# EAGLE schematic asset-tracker-v002 (EAGLE 7.5.0)
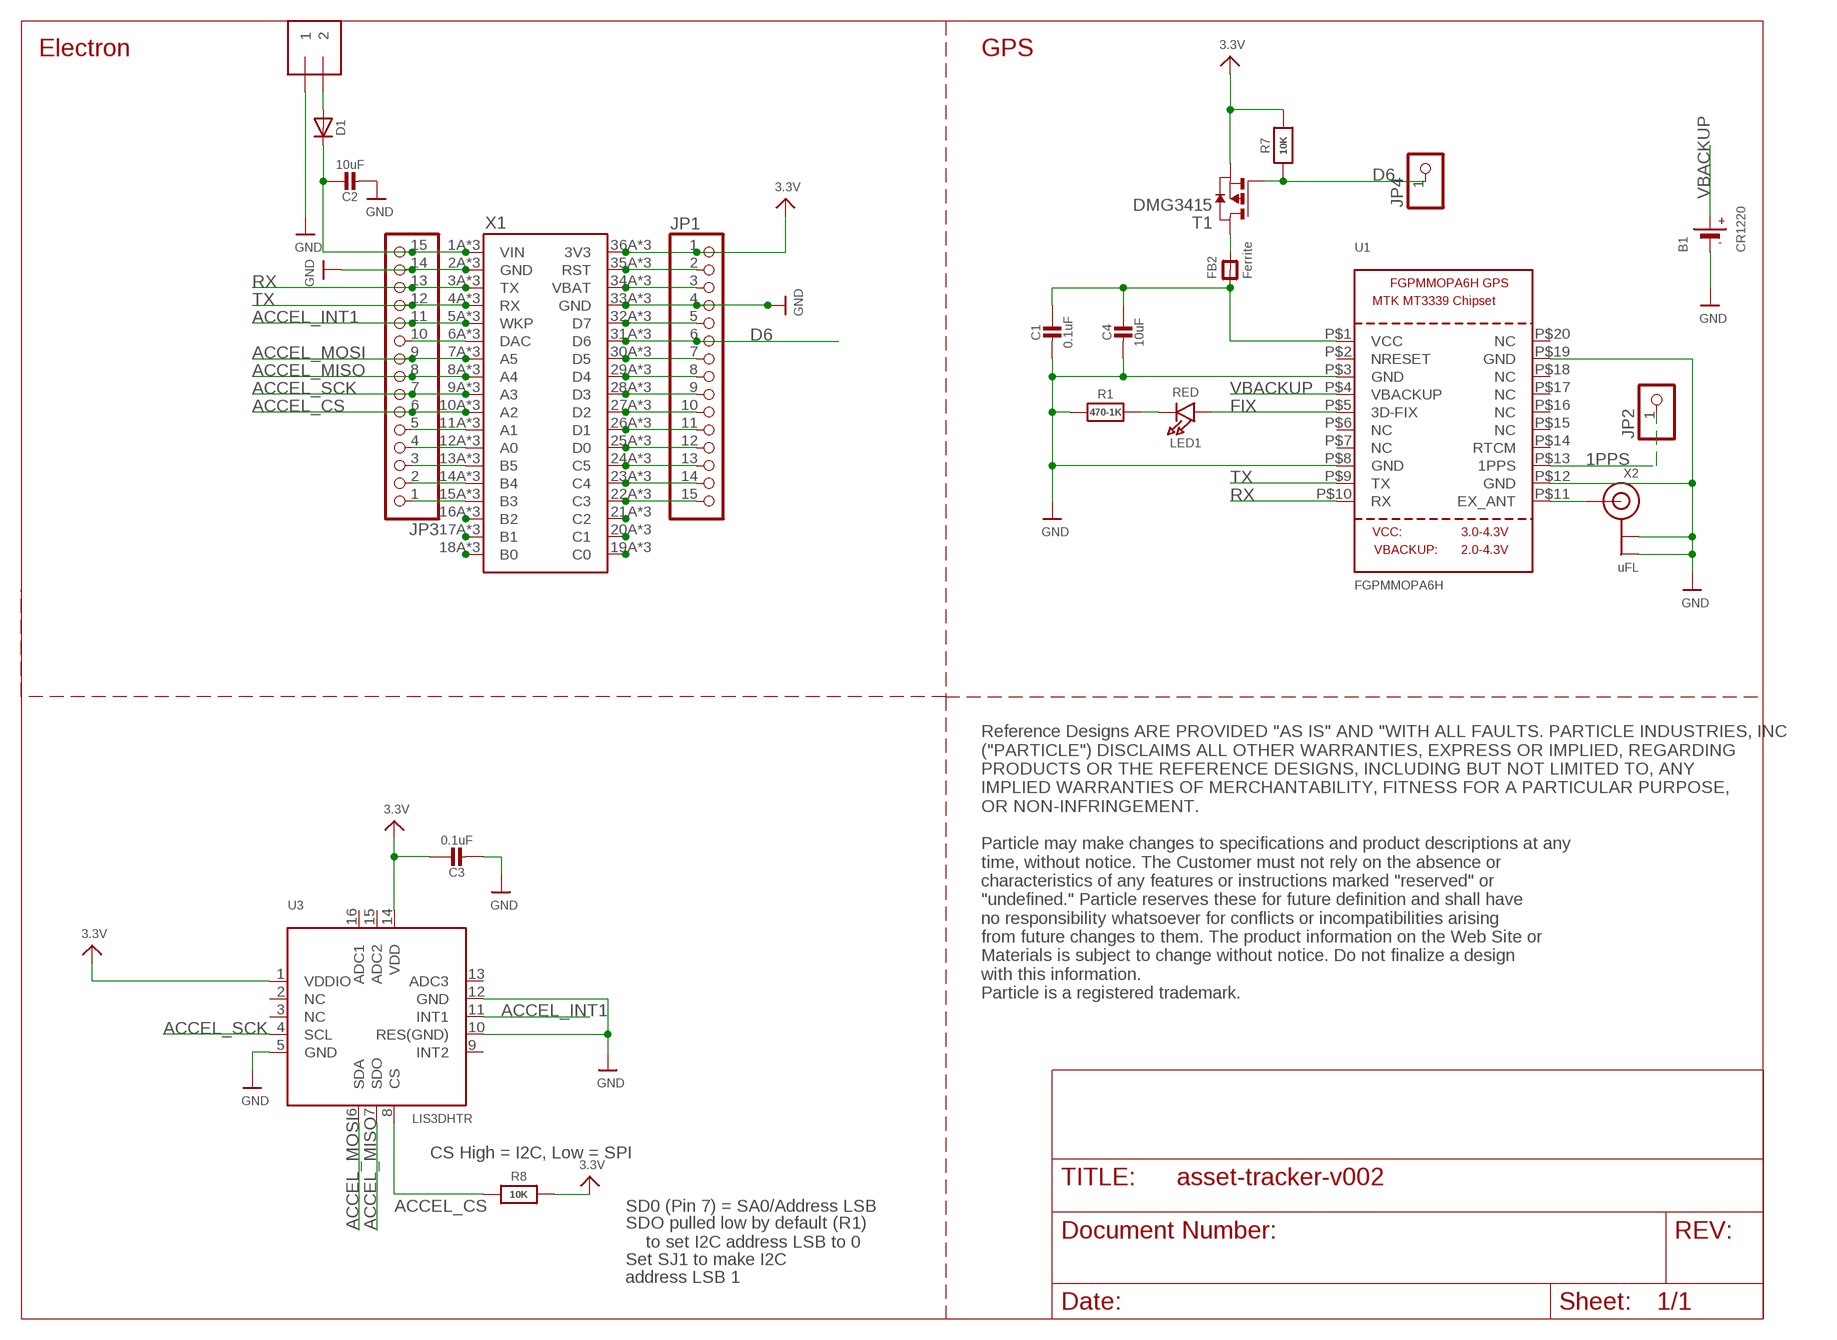
[diagram p0: schematic, sheet 1]

## Parts
B1  CR1220  BATTERYCR1220_SMT  [CR1220]
C1  0.1uF  CAP_CERAMIC0805-NOOUTLINE  [0805-NO@1]
C2  10uF  CAP_CERAMIC0805-NOOUTLINE  [0805-NO@1]
C3  0.1uF  CAP_CERAMIC0805_10MGAP  [0805_10MGAP]
C4  10uF  CAP_CERAMIC0805-NOOUTLINE  [0805-NO@1]
D1  DIODESMA  [SMADIODE]
FB2  Ferrite  FERRITE-0805NO  [0805-NO@1]
J1  1X2-3.5MM  [1X2-3.5MM]
JP1  HEADER-1X15  [1X15_ROUND_70]
JP2  HEADER-1X1ROUND  [1X01_ROUND]
JP3  HEADER-1X15  [1X15_ROUND_70]
JP4  HEADER-1X1ROUND  [1X01_ROUND]
LED1  RED  LED0805_NOOUTLINE  [CHIPLED_0805_NOOUTLINE]
R1  470-1K  RESISTOR0805_NOOUTLINE  [0805-NO]
R7  10K  RESISTOR0805_NOOUTLINE  [0805-NO]
R8  10K  RESISTOR0805_NOOUTLINE  [0805-NO]
T1  DMG3415  PMOSSOT23  [SOT-23]
U1  FGPMMOPA6H  GPS_FGPMMOPA6H  [FGPMMOPA6H]
U3  LIS3DHTR  ACCEL_LIS3DHTR  [LGA16_3X3MM]
X1  ELECTRON  ELECTRON_SMT  [ELECTRON_SMT]
X2  uFL  ANTENNA_U.FL  [U.FL]

## Nets
1PPS: JP2.1 U1.P$13(1PPS)
3.3V: C3.1 JP1.1 R7.2 R8.2 T1.2(S) U3.1(VDDIO) U3.14(VDD) X1.36A(3V3) X1.36B(3V3) X1.36C(3V3)
A0: JP3.4 X1.12A(A0) X1.12B(A0) X1.12C(A0)
A1: JP3.5 X1.11A(A1) X1.11B(A1) X1.11C(A1)
ACCEL_CS: JP3.6 R8.1 U3.8(CS) X1.10A(A2) X1.10B(A2) X1.10C(A2)
ACCEL_INT1: JP3.11 U3.11(INT1) X1.5A(WKP) X1.5B(WKP) X1.5C(WKP)
ACCEL_MISO: JP3.8 U3.7(SDO) X1.8A(A4) X1.8B(A4) X1.8C(A4)
ACCEL_MOSI: JP3.9 U3.6(SDA) X1.7A(A5) X1.7B(A5) X1.7C(A5)
ACCEL_SCK: JP3.7 U3.4(SCL) X1.9A(A3) X1.9B(A3) X1.9C(A3)
B3: JP3.1 X1.15A(B3) X1.15B(B3) X1.15C(B3)
B4: JP3.2 X1.14A(B4) X1.14B(B4) X1.14C(B4)
B5: JP3.3 X1.13A(B5) X1.13B(B5) X1.13C(B5)
C3: JP1.15 X1.22A(C3) X1.22B(C3) X1.22C(C3)
C4: JP1.14 X1.23A(C4) X1.23B(C4) X1.23C(C4)
C5: JP1.13 X1.24A(C5) X1.24B(C5) X1.24C(C5)
D0: JP1.12 X1.25A(D0) X1.25B(D0) X1.25C(D0)
D1: JP1.11 X1.26A(D1) X1.26B(D1) X1.26C(D1)
D2: JP1.10 X1.27A(D2) X1.27B(D2) X1.27C(D2)
D3: JP1.9 X1.28A(D3) X1.28B(D3) X1.28C(D3)
D4: JP1.8 X1.29A(D4) X1.29B(D4) X1.29C(D4)
D5: JP1.7 X1.30A(D5) X1.30B(D5) X1.30C(D5)
D6: JP1.6 JP4.1 R7.1 T1.3(G) X1.31A(D6) X1.31B(D6) X1.31C(D6)
D7: JP1.5 X1.32A(D7) X1.32B(D7) X1.32C(D7)
DAC: JP3.10 X1.6A(DAC) X1.6B(DAC) X1.6C(DAC)
FIX: LED1.A U1.P$5(3D-FIX)
GND: B1.- C1.2 C2.2 C3.2 C4.2 J1.1 JP1.4 JP3.14 R1.1 U1.P$3(GND) U1.P$8(GND) U1.P$12(GND) U1.P$19(GND) U3.5(GND) U3.10(RES(GND)) U3.12(GND) X1.2A(GND) X1.2B(GND) X1.2C(GND) X1.33A(GND) X1.33B(GND) X1.33C(GND) X2.1(GND) X2.2(GND)
N$1: C1.1 C4.1 FB2.1 U1.P$1(VCC)
N$2: LED1.C R1.2
N$4: U1.P$11(EX_ANT) X2.3(SIGNAL)
N$8: C2.1 D1.C JP3.15 X1.1A(VIN) X1.1B(VIN) X1.1C(VIN)
N$9: D1.A J1.2
N$10: X1.16A(B2) X1.16B(B2) X1.16C(B2)
N$11: X1.17A(B1) X1.17B(B1) X1.17C(B1)
N$12: X1.18A(B0) X1.18B(B0) X1.18C(B0)
N$13: X1.21A(C2) X1.21B(C2) X1.21C(C2)
N$14: X1.20A(C1) X1.20B(C1) X1.20C(C1)
N$15: X1.19A(C0) X1.19B(C0) X1.19C(C0)
RST: JP1.2 X1.35A(RST) X1.35B(RST) X1.35C(RST)
RX: JP3.13 U1.P$10(RX) X1.3A(TX) X1.3B(TX) X1.3C(TX)
TX: JP3.12 U1.P$9(TX) X1.4A(RX) X1.4B(RX) X1.4C(RX)
VBACKUP: B1.+$1(+) U1.P$4(VBACKUP)
VBAT: JP1.3 X1.34A(VBAT) X1.34B(VBAT) X1.34C(VBAT)
VCC: FB2.2 T1.1(D)
Unconnected: U1.P$2(NRESET) U1.P$6(NC) U1.P$7(NC) U1.P$14(RTCM) U1.P$15(NC) U1.P$16(NC) U1.P$17(NC) U1.P$18(NC) U1.P$20(NC) U3.2(NC) U3.3(NC) U3.9(INT2) U3.13(ADC3) U3.15(ADC2) U3.16(ADC1)

## Notes on the sheet
- Electron | GPS
- Reference Designs ARE PROVIDED "AS IS" AND "WITH ALL FAULTS. PARTICLE INDUSTRIES, INC 
  ("PARTICLE") DISCLAIMS ALL OTHER WARRANTIES, EXPRESS OR IMPLIED, REGARDING 
  PRODUCTS OR THE REFERENCE DESIGNS, INCLUDING BUT NOT LIMITED TO, ANY 
  IMPLIED WARRANTIES OF MERCHANTABILITY, FITNESS FOR A PARTICULAR PURPOSE,
  OR NON-INFRINGEMENT.
  
  Particle may make changes to specifications and product descriptions at any 
  time, without notice. The Customer must not rely on the absence or 
  characteristics of any features or instructions marked "reserved" or 
  "undefined." Particle reserves these for future definition and shall have 
  no responsibility whatsoever for conflicts or incompatibilities arising 
  from future changes to them. The product information on the Web Site or 
  Materials is subject to change without notice. Do not finalize a design 
  with this information. 
  Particle is a registered trademark.
- CS High = I2C, Low = SPI
- SD0 (Pin 7) = SA0/Address LSB
- SDO pulled low by default (R1) 
      to set I2C address LSB to 0
- Set SJ1 to make I2C
- address LSB 1

## Library data of the parts
B1 = microbuilder:BATTERY: CR1220 SMT - Digikey: 3001K-ND CD2032 BAT-HLD-001 - Digikey: BAT-HLD-001-ND
C1-C4 = microbuilder:CAP_CERAMIC: Ceramic Capacitors For new designs, use the packages preceded by an '_' character since they are more reliable: The following footprints should be used on most boards: _0402 - Standard footprint for regular board layouts _0603 - Standard footprint for regular board layouts _0805 - Standard footprint for regular board layouts _1206 - Standard footprint for regular board layouts For extremely tight-pitch boards where space is at a premium, the following 'micro-pitch' footprints can be used (smaller pads, no silkscreen outline, etc.): _0402MP - Micro-pitch footprint for very dense/compact boards _0603MP - Micro-pitch footprint for very dense/compact boards _0805MP - Micro-pitch footprint for very dense/compact boards _1206MP - Micro-pitch footprint for very dense/compact boards
D1 = microbuilder:DIODE: Diode SMA Model Volts Amps Type Vf Ir Digikey # Notes SSA34-E3 40V 3A Schottky 480mV @ 3A 200uA @ 40V SSA34-E3/61TGITR-ND CDBA120-G 20V 1A Schottky 500mV @ 1A 500uA @ 20V 641-1014-6-ND REEL MBRA210 10V 2A Schottky 350mV @ 2A 700uA @ 10V MBRA210LT3 SOD-123 Model Volts Amps Type Vf Ir Order # Notes BAT54T1G 30V 200mA Schottky 800mV @ 200mA 2uA @ 25V BAT54T1GOSTR-ND B0530W 30V 500mA Schottky 430mV @ 500mA 130uA @ 30V B0530W-FDICT-ND REEL MBR120 20V 1A Schottky 340mV @ 1A MBR120VLSFT1GOSCT-ND SOD-323 Model Volts Amps Type Vf Ir Order # Notes PMEG2005EJ 20V 500mA Schottky 355mV @ 500mA 568-4110-1-ND ZLLS410 10V 570mA Schottky 380mV @ 570mA ZLLS410CT-ND 1N4148WS 75V 150mA Silicon/Simple 1V 1N4148WSFSCT-ND REEL SOD-523 Model Volts Amps Type Vf Ir Order # Notes BAT54XV2 30V 200mA Schottky 0.8V @ 100mA BAT54XV2CT-ND TB751S 30V 30mA Schottky RB751S-40TE61CT-ND SOT23-R/W (R = Solder Paste/Reflow Ovens, W = Hand-Soldering) Model Volts Amps Type Vf Ir Order # Notes BAT54FILM 40V 300mA Schottky 497-7162-1-ND POWERDI-5 Model Volts Amps Type Vf Ir Order # Notes PDS560 60V 5A Schottky 670mV @ 5A 150uA @ 60V PDS560DICT-ND
FB2 = microbuilder:FERRITE: Ferrite Bead 0603 MMZ1608B121C - 120 Ohm @ 100MHz, 600mA, 0.15 Ohm DC Resistance - Digikey: 445-2164-1-ND BK1608HW121-T - 120 Ohm, 600mA Ferrite Chip - Digikey: 587-1876-2-ND 0805 HZ0805B272R-10 - 2.7K Ohm @ 100MHz, 200mA, 0.8 Ohm DC Resistance - Digikey: 240-2504-1-ND (see also Murata BLM21BD272SN1L) MMZ2012Y152B - 1.5K Ohm @ 100MHz, 500mA, 0.4 Ohm DC Resistance - Digikey: 445-1560-1-ND - Mainly for high frequency (80-400MHz) MMZ2012R102A - 1K Ohm @ 100MHz, 500mA, 0.3 Ohm DC Resistance - Digikey: 445-1555-2-ND - More general purpose (10-200MHz)
J1 = adafruit2:1X2: 3.5mm Terminal block http://www.ladyada.net/library/pcb/eaglelibrary.html
JP1 JP3 = microbuilder:HEADER-1X15: 1x15 Header
JP2 JP4 = microbuilder:HEADER-1X1: PIN HEADER
LED1 = microbuilder:LED: LED 0603 - 0603 Surface Mount Package 2mA: Green LED - Low Power (3.9mcd, 2ma, 1.7Vf) - Digikey: 475-2709-2-ND Orange LED - Low Power (9.8mcd, 2ma, 1.8Vf) - Digikey: 475-1194-2-ND Red LED - Low Power (5mcd, 2ma, 1.8Vf) - Digikey: 475-1195-2-ND Yellow LED - Low Power (7mcd, 2ma, 1.8Vf) - Digikey: 475-1196-2-ND 5mA: Blue LED - Low Power (17mcd, 5ma, 2.9Vf) - Digikey: LNJ937W8CRACT-ND 0805 - 0805 Surface Mount Package 2mA: Red LED (8.8mcd, 2mA, 1.8Vf, Clear) - Low Power [Digikey: 475-2510-1-ND] Green LED (5mcd, 2mA, 1.8Vf, Clear) - Low Power [Digikey: 475-2730-1-ND] Yellow LED (11.3mcd, 2mA, 1.8Vf, Clear) - Low Power [Digikey: 475-2555-1-ND] 20mA: Red LED (104mcd, 20mA, Diffused) - LS R976 [Digikey: 475-1278-6-ND] Red LED (12mcd, 20mA, 2.0Vf, Clear) - APT2012EC [Digikey: 754-1128-1-ND] Green LED (15mcd, 20mA, 2.2Vf, Clear) - APT2012GC [Digikey: 754-1131-1-ND] Orange LED (160mcd, 20mA, 2.1Vf, Clear) - APT2012SECK [Digikey: 754-1130-1-ND] 1206 - 1206 Surface Mount Package Green LED (26mcd, 20mA, Diffused) - LG N971 [Digikey: 475-1407-6-ND] Red LED (15mcd, 20mA, Diffused) - LH N974 [Digikey: 475-1416-6-ND] Cree - Cree High-Power Surface Mount LEDs XPEBWT-L1-0000-00D50 - White 111lm 350mA 2.9Vf 6200K 110° XTEAWT-00-0000-00000LEE3 - White 114lm 350mA 2.85Vf 5000K 115° Everlight - Everlight 45-21 Series Surface Mount LEDs 45-21/QK2C-B2832AC2CB2/2T - Warm White 2000mcd 20mA 3.25Vf 3050K 120° 45-21/LK2C-B38452C4CB2/2T - Nuetral White 2000mcd 20mA 3.25Vf 4150K 120° 45-21/LK2C-B50634C6CB2/2T - Cold White 2200mcd 20mA 3.25Vf 5650K 120° PLCC2 Reverse Mount LS T77K-J1L2-1-0-2-R18-Z - Red 11.25mcd 2mA 1.8Vf 630nm 120° LO T77K-L1M2-24-Z - Orange 19.6mcd 2mA 1.8Vf 606nm 120° LY T77K-K2M1-26-Z - Yellow 15.7mcd 2mA 1.8Vf 587nm 120°
R1 R7 R8 = microbuilder:RESISTOR: Resistors For new designs, use the packages preceded by an '_' character since they are more reliable: The following footprints should be used on most boards: _0402 - Standard footprint for regular board layouts _0603 - Standard footprint for regular board layouts _0805 - Standard footprint for regular board layouts _1206 - Standard footprint for regular board layouts For extremely tight-pitch boards where space is at a premium, the following 'micro-pitch' footprints can be used (smaller pads, no silkscreen outline, etc.): _0402MP - Micro-pitch footprint for very dense/compact boards _0603MP - Micro-pitch footprint for very dense/compact boards _0805MP - Micro-pitch footprint for very dense/compact boards _1206MP - Micro-pitch footprint for very dense/compact boards
T1 = zetex:PMOSSOT23: MOS FET; OC_FARNELL: unknown; OC_NEWARK: unknown
U1 = microbuilder:GPS_FGPMMOPA6H: GPS Module - MTK MT3339 Chipset, -165dBm sensitivity, 22 channels, 10Hz, auto-select external antenna options
U3 = microbuilder:ACCEL_LIS3DHTR: LIS3DHTR 3-Axis Accelerometer with I2C/SPI Interface VDD: 1.71-3.6V VDDIO: 1.71-VDD+0.1V Scale: +/-2g, 4g, 8g, 16g with 16--bit data output Temp:: -40°C - 85°C Mouser: 511-LIS3DHTR Digikey: 497-10613-1-ND
X1 = microbuilder:ELECTRON
X2 = microbuilder:ANTENNA_U.FL: U.FL Antenna Connector